# Altium schematic sheet JetsonNano_v1.SchDoc
size A2
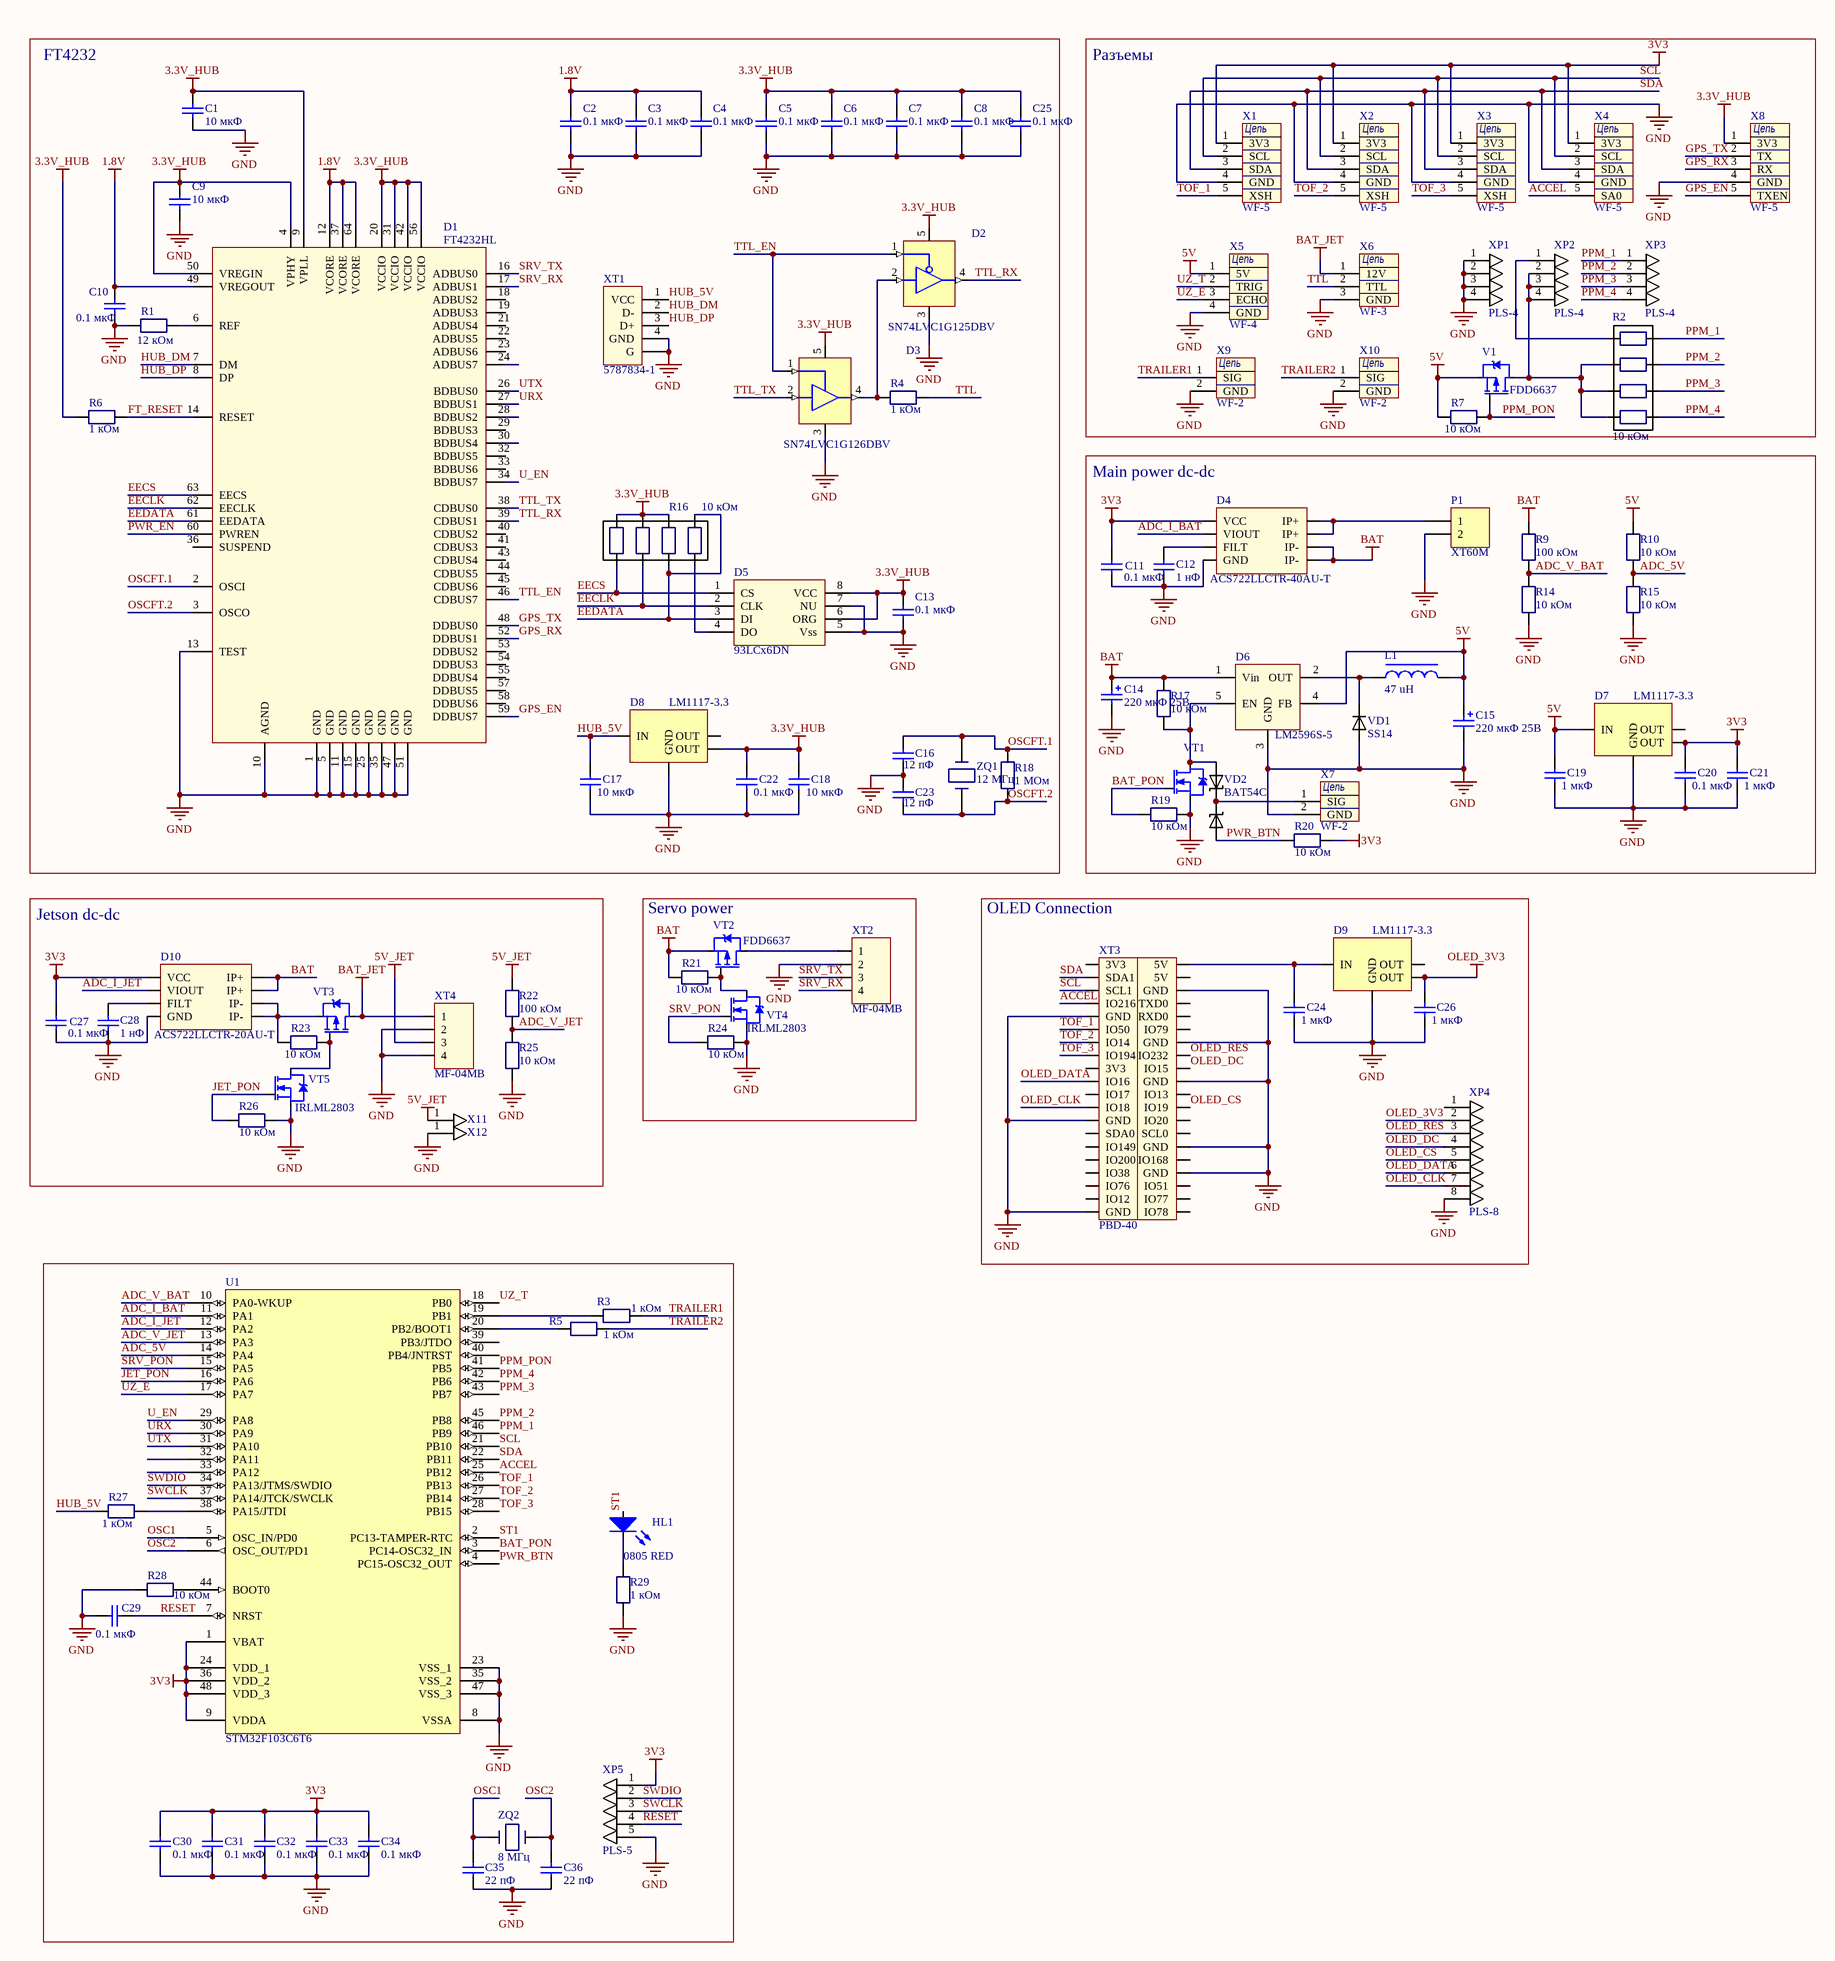
[diagram p0: JetsonNano_v1.SchDoc]

## Parts
C1  value 10 мкФ  [0805]  (hidden comment: C0805)
C2  value 0.1 мкФ  [0805]  (hidden comment: C0805)
C3  value 0.1 мкФ  [0805]  (hidden comment: C0805)
C4  value 0.1 мкФ  [0805]  (hidden comment: C0805)
C5  value 0.1 мкФ  [0805]  (hidden comment: C0805)
C6  value 0.1 мкФ  [0805]  (hidden comment: C0805)
C7  value 0.1 мкФ  [0805]  (hidden comment: C0805)
C8  value 0.1 мкФ  [0805]  (hidden comment: C0805)
C9  value 10 мкФ  [0805]  (hidden comment: C0805)
C10  value 0.1 мкФ  [0805]  (hidden comment: C0805)
C11  value 0.1 мкФ  [0805]  (hidden comment: C0805)
C12  value 1 нФ  [0805]  (hidden comment: C0805)
C13  value 0.1 мкФ  [0805]  (hidden comment: C0805)
C14  220 мкФ 25В  [CAPPR3.5-8x12]
C15  220 мкФ 25В  [CAPPR3.5-8x12]
C16  value 12 пФ  [0805]  (hidden comment: C0805)
C17  value 10 мкФ  [0805]  (hidden comment: C0805)
C18  value 10 мкФ  [0805]  (hidden comment: C0805)
C19  value 1 мкФ  [0805]  (hidden comment: C0805)
C20  value 0.1 мкФ  [0805]  (hidden comment: C0805)
C21  value 1 мкФ  [0805]  (hidden comment: C0805)
C22  value 0.1 мкФ  [0805]  (hidden comment: C0805)
C23  value 12 пФ  [0805]  (hidden comment: C0805)
C24  value 1 мкФ  [0805]  (hidden comment: C0805)
C25  value 0.1 мкФ  [0805]  (hidden comment: C0805)
C26  value 1 мкФ  [0805]  (hidden comment: C0805)
C27  value 0.1 мкФ  [0805]  (hidden comment: C0805)
C28  value 1 нФ  [0805]  (hidden comment: C0805)
C29  value 0.1 мкФ  [0805]  (hidden comment: C0805)
C30  value 0.1 мкФ  [0805]  (hidden comment: C0805)
C31  value 0.1 мкФ  [0805]  (hidden comment: C0805)
C32  value 0.1 мкФ  [0805]  (hidden comment: C0805)
C33  value 0.1 мкФ  [0805]  (hidden comment: C0805)
C34  value 0.1 мкФ  [0805]  (hidden comment: C0805)
C35  value 22 пФ  [0805]  (hidden comment: C0805)
C36  value 22 пФ  [0805]  (hidden comment: C0805)
D1  FT4232HL  [FT4232HL]
D2  SN74LVC1G125DBV  [SOT23-5]
D3  SP: SN74LVC1G126DBV  [SOT23-5]  (hidden comment: SN74LVC1G126DBV_1)
D4  ACS722LLCTR-40AU-T  [SOIC-8]
D5  93LCx6DN  [SOIC-8]
D6  LM2596S-5  [TO-263]
D7  LM1117-3.3  [SOT223]
D8  LM1117-3.3  [SOT223]
D9  LM1117-3.3  [SOT223]
D10  ACS722LLCTR-20AU-T  [SOIC-8]
HL1  0805 RED  [LED0805]
L1  47 uH  [CDRH127]
P1  XT60M  [XT60]
R1  value 12 кОм  [P0805]  (hidden comment: R0805)
R2  value 10 кОм  [ResArray4]  (hidden comment: cat16-103j4lf)
R3  value 1 кОм  [P0805]  (hidden comment: R0805 (1%))
R4  value 1 кОм  [P0805]  (hidden comment: R0805 (1%))
R5  value 1 кОм  [P0805]  (hidden comment: R0805 (1%))
R6  value 1 кОм  [P0805]  (hidden comment: R0805)
R7  value 10 кОм  [P0805]  (hidden comment: R0805 (1%))
R9  value 100 кОм  [P0805]  (hidden comment: R0805 (1%))
R10  value 10 кОм  [P0805]  (hidden comment: R0805 (1%))
R14  value 10 кОм  [P0805]  (hidden comment: R0805 (1%))
R15  value 10 кОм  [P0805]  (hidden comment: R0805 (1%))
R16  value 10 кОм  [ResArray4]  (hidden comment: cat16-103j4lf)
R17  value 10 кОм  [P0805]  (hidden comment: R0805)
R18  value 1 МОм  [P0805]  (hidden comment: R0805)
R19  value 10 кОм  [P0805]  (hidden comment: R0805)
R20  value 10 кОм  [P0805]  (hidden comment: R0805)
R21  value 10 кОм  [P0805]  (hidden comment: R0805 (1%))
R22  value 100 кОм  [P0805]  (hidden comment: R0805 (1%))
R23  value 10 кОм  [P0805]  (hidden comment: R0805 (1%))
R24  value 10 кОм  [P0805]  (hidden comment: R0805)
R25  value 10 кОм  [P0805]  (hidden comment: R0805 (1%))
R26  value 10 кОм  [P0805]  (hidden comment: R0805)
R27  value 1 кОм  [P0805]  (hidden comment: R0805 (1%))
R28  value 10 кОм  [P0805]  (hidden comment: R0805)
R29  value 1 кОм  [P0805]  (hidden comment: R0805 (1%))
U1  STM32F103C6T6  [LQFP-48]
V1  FDD6637  [TO-252]
VD1  SS14  [SMA]
VD2  BAT54C  [SOT-23]
VT1  IRLML2803  [SOT-23]  (value not drawn)
VT2  FDD6637  [TO-252]
VT3  D2PAK_P_CH  [TO-263-2]  (value not drawn)
VT4  IRLML2803  [SOT-23]
VT5  IRLML2803  [SOT-23]
X1  WF-5  [WF-5]
X2  WF-5  [WF-5]
X3  WF-5  [WF-5]
X4  WF-5  [WF-5]
X5  WF-4  [WF-4]
X6  WF-3  [WF-3]
X7  WF-2  [WF-2]
X8  WF-5  [WF-5]
X9  WF-2  [WF-2]
X10  WF-2  [WF-2]
X11  (no value)  [Pad2]
X12  (no value)  [Pad2]
XP1  PLS-4  [PLS-4]
XP2  PLS-4  [PLS-4]
XP3  PLS-4  [PLS-4]
XP4  PLS-8  [PLS-8]
XP5  PLS-5  [PLS-5]
XT1  value 5787834-1  [USB_B]  (hidden comment: 1734366-1)
XT2  value MF-04MB  [MF-04MB]  (hidden comment: MF-04MRA)
XT3  PBD-40  [PBD-40RB]
XT4  value MF-04MB  [MF-04MB]  (hidden comment: MF-04MRA)
ZQ1  value 12 МГц  [HC-49/U]  (hidden comment: 8 МГц)
ZQ2  8 МГц  [HC-49/U]

## Blocks framed on the sheet
FT4232: C1-C10 C13 C16-C18 C22 C23 C25 D1-D3 D5 D8 R1 R4 R6 R16 R18 XT1 ZQ1
Разъемы: R2 R7 V1 X1-X6 X8-X10 XP1-XP3
Main power dc-dc: C11 C12 C14 C15 C19-C21 D4 D6 D7 L1 P1 R9 R10 R14 R15 R17 R19 R20 VD1 VD2 VT1 X7
Jetson dc-dc: C27 C28 D10 R22 R23 R25 R26 VT3 VT5 X11 X12 XT4
Servo power: R21 R24 VT2 VT4 XT2
OLED Connection: C24 C26 D9 XP4 XT3

## Nets
1.8V: C2.2 C3.2 C4.2 C10.2 D1.12(VCORE) D1.37(VCORE) D1.49(VREGOUT) D1.64(VCORE)
3.3V_HUB: C1.2 C5.2 C6.2 C7.2 C8.2 C9.2 C13.2 C18.2 C22.2 C25.2 D1.4(VPHY) D1.9(VPLL) D1.20(VCCIO) D1.31(VCCIO) D1.42(VCCIO) D1.50(VREGIN) D1.56(VCCIO) D2.5(VCC) D3.5(VCC) D5.6(ORG) D5.8(VCC) D8.4(OUT) R6.2 R16.6 R16.7 R16.8 X8.1(3V3)
3V3: C11.1 C20.2 C21.2 C27.1 C30.2 C31.2 C32.2 C33.2 C34.2 D4.8(VCC) D7.4(OUT) D10.8(VCC) R20.1 U1.1(VBAT) U1.9(VDDA) U1.24(VDD_1) U1.36(VDD_2) U1.48(VDD_3) X1.1(3V3) X2.1(3V3) X3.1(3V3) X4.1(3V3) XP5.1
5V: C15.1 C19.2 D6.4(FB) D7.3(IN) L1.2 R7.1 R10.2 V1.3(S) X5.1(5V)
5V_JET: R22.2 X11.1 XT4.3
BAT: C14.1 D4.3(IP-) D4.4(IP-) D6.1(Vin) D10.1(IP+) D10.2(IP+) R9.2 R17.1 R21.1 VT2.3(S)
BAT_JET: VT3.2(D) X6.1(12V) XT4.1
GND: C1.1 C2.1 C3.1 C4.1 C5.1 C6.1 C7.1 C8.1 C9.1 C10.1 C11.2 C12.1 C13.1 C14.2 C15.2 C16.1 C17.1 C18.1 C19.1 C20.1 C21.1 C22.1 C23.2 C24.1 C25.1 C26.1 C27.2 C28.1 C29.2 C30.1 C31.1 C32.1 C33.1 C34.1 C35.1 C36.1 D1.1(GND) D1.5(GND) D1.10(AGND) D1.11(GND) D1.13(TEST) D1.15(GND) D1.25(GND) D1.35(GND) D1.47(GND) D1.51(GND) D2.3(GND) D3.3(GND) D4.5(GND) D5.5(Vss) D5.7(NU) D6.3(GND) D7.1(GND) D8.1(GND) D9.1(GND) D10.5(GND) P1.2 R1.2 R14.2 R15.2 R19.1 R24.1 R25.2 R26.1 R28.2 R29.1 U1.8(VSSA) U1.23(VSS_1) U1.35(VSS_2) U1.47(VSS_3) VD1.2(A) VT1.2(S) VT4.2(S) VT5.2(S) X1.4(GND) X2.4(GND) X3.4(GND) X4.4(GND) X5.4(GND) X6.3(GND) X7.2(GND) X8.4(GND) X9.2(GND) X10.2(GND) X12.1 XP1.1 XP1.2 XP1.3 XP1.4 XP4.8 XP5.5 XT1.4(GND) XT1.G XT2.2 XT3.6(GND) XT3.9(GND) XT3.14(GND) XT3.20(GND) XT3.25(GND) XT3.30(GND) XT3.34(GND) XT3.39(GND) XT4.2 XT4.4
OLED_3V3: C26.2 D9.4(OUT) XP4.2
ACCEL: U1.25(PB12) X4.5(SA0) XT3.7(IO216)
ADC_5V: R10.1 R15.1 U1.14(PA4)
ADC_I_BAT: D4.7(VIOUT) U1.11(PA1)
ADC_I_JET: D10.7(VIOUT) U1.12(PA2)
ADC_V_BAT: R9.1 R14.1 U1.10(PA0-WKUP)
ADC_V_JET: R22.1 R25.1 U1.13(PA3)
BAT_PON: R19.2 U1.3(PC14-OSC32_IN) VT1.1(G)
EECLK: D1.62(EECLK) D5.2(CLK) R16.2
EECS: D1.63(EECS) D5.1(CS) R16.1
EEDATA: D1.61(EEDATA) D5.3(DI) R16.3 R16.5
FT_RESET: D1.14(RESET) R6.1
GPS_EN: D1.59(DDBUS7) X8.5(TXEN)
GPS_RX: D1.52(DDBUS1) X8.3(RX)
GPS_TX: D1.48(DDBUS0) X8.2(TX)
HUB_5V: C17.2 D8.3(IN) R27.1 XT1.1(VCC)
HUB_DM: D1.7(DM) XT1.2(D-)
HUB_DP: D1.8(DP) XT1.3(D+)
JET_PON: R26.2 U1.16(PA6) VT5.1(G)
OLED_CLK: XP4.7 XT3.23(IO18)
OLED_CS: XP4.5 XT3.24(IO19)
OLED_DATA: XP4.6 XT3.19(IO16)
OLED_DC: XP4.4 XT3.18(IO15)
OLED_RES: XP4.3 XT3.16(IO232)
OSC1: C35.2 U1.5(OSC_IN/PD0) ZQ2.1
OSC2: C36.2 U1.6(OSC_OUT/PD1) ZQ2.2
OSCFT.1: C16.2 D1.2(OSCI) R18.1 ZQ1.2
OSCFT.2: C23.1 D1.3(OSCO) R18.2 ZQ1.1
PPM_1: R2.5 U1.46(PB9) XP3.1
PPM_2: R2.6 U1.45(PB8) XP3.2
PPM_3: R2.7 U1.43(PB7) XP3.3
PPM_4: R2.8 U1.42(PB6) XP3.4
PPM_PON: R7.2 U1.41(PB5) V1.1(G)
PWR_BTN: R20.2 U1.4(PC15-OSC32_OUT) VD2.1(A)
PWR_EN: D1.60(PWREN)
RESET: C29.1 U1.7(NRST) XP5.4
SCL: U1.21(PB10) X1.2(SCL) X2.2(SCL) X3.2(SCL) X4.2(SCL) XT3.5(SCL1)
SDA: U1.22(PB11) X1.3(SDA) X2.3(SDA) X3.3(SDA) X4.3(SDA) XT3.3(SDA1)
SRV_PON: R24.2 U1.15(PA5) VT4.1(G)
SRV_RX: D1.17(ADBUS1) XT2.4
SRV_TX: D1.16(ADBUS0) XT2.3
ST1: HL1.1(A) U1.2(PC13-TAMPER-RTC)
SWCLK: U1.37(PA14/JTCK/SWCLK) XP5.3
SWDIO: U1.34(PA13/JTMS/SWDIO) XP5.2
TOF_1: U1.26(PB13) X1.5(XSH) XT3.11(IO50)
TOF_2: U1.27(PB14) X2.5(XSH) XT3.13(IO14)
TOF_3: U1.28(PB15) X3.5(XSH) XT3.15(IO194)
TRAILER1: R3.1 X9.1(SIG)
TRAILER2: R5.1 X10.1(SIG)
TTL: R4.2 X6.2(TTL)
TTL_EN: D1.46(CDBUS7) D2.1(A) D3.1(A)
TTL_RX: D1.39(CDBUS1) D2.4(OUT)
TTL_TX: D1.38(CDBUS0) D3.2(B)
U_EN: D1.34(BDBUS7) U1.29(PA8)
URX: D1.27(BDBUS1) U1.30(PA9)
UTX: D1.26(BDBUS0) U1.31(PA10)
UZ_E: U1.17(PA7) X5.3(ECHO)
UZ_T: U1.18(PB0) X5.2(TRIG)
NetC12_2: C12.2 D4.6(FILT)
NetC24_2: C24.2 D9.3(IN) XT3.2(5V)
NetC28_2: C28.2 D10.6(FILT)
NetD1_6: D1.6(REF) R1.1
NetD2_2: D2.2(B) D3.4(OUT) R4.1
NetD4_1: D4.1(IP+) D4.2(IP+) P1.1
NetD5_4: D5.4(DO) R16.4
NetD6_2: D6.2(OUT) L1.1 VD1.1(K)
NetD6_5: D6.5(EN) R17.2 VD2.2(A) VT1.3(D)
NetD10_3: D10.3(IP-) D10.4(IP-) R23.1 VT3.3(S)
NetHL1_2: HL1.2(C) R29.2
NetR2_1: R2.1 R2.2 R2.3 V1.2(D) XP2.2 XP2.3 XP2.4
NetR2_4: R2.4 XP2.1
NetR3_2: R3.2 U1.19(PB1)
NetR5_2: R5.2 U1.20(PB2/BOOT1)
NetR21_2: R21.2 VT2.1(G) VT4.3(D)
NetR23_2: R23.2 VT3.1(G) VT5.3(D)
NetR27_2: R27.2 U1.38(PA15/JTDI)
NetR28_1: R28.1 U1.44(BOOT0)
NetVD2_3: VD2.3(K) X7.1(SIG)
NetVT2_2: VT2.2(D) XT2.1

Not connected (* = marked no-connect by the designer): D1 18(ADBUS2) 19(ADBUS3) 21(ADBUS4) 22(ADBUS5) 23(ADBUS6) 24(ADBUS7) 28(BDBUS2) 29(BDBUS3) 30(BDBUS4) 32(BDBUS5) 33(BDBUS6) 36(SUSPEND) 40(CDBUS2) 41(CDBUS3) 43(CDBUS4) 44(CDBUS5) 45(CDBUS6) 53(DDBUS2) 54(DDBUS3) 55(DDBUS4) 57(DDBUS5) 58(DDBUS6); D7 2(OUT); D8 2(OUT); D9 2(OUT); U1 32(PA11) 33(PA12) 39(PB3/JTDO) 40(PB4/JNTRST); XP4 1; XT3 1(3V3) 4(5V) 8(TXD0) 10(RXD0) 12(IO79) 17(3V3) 21(IO17) 22(IO13) 26(IO20) 27(SDA0) 28(SCL0) 29(IO149) 31(IO200) 32(IO168) 33(IO38) 35(IO76) 36(IO51) 37(IO12) 38(IO77) 40(IO78)

## Notes on the sheet
- (in symbol WF-2) Цепь
- (in symbol WF-3) Цепь
- (in symbol WF-4) Цепь
- (in symbol WF-5) Цепь

## Library data of the parts
C1-C13 C16-C36 = C0805: Чип конденсатор 0805; SP: Чип конденсатор 0805 X7R
C14 C15 = K50-35: Чип конденсатор танталовый "A"; SP: Конденсатор  SH025M0220A5S-0811; Value: 220 мкФ 25В
D4 D10 = ACS712
  D4: SP: ACS722LLCTR-40AU-T
  D10: SP: ACS722LLCTR-20AU-T
D5 = 93LC46: Microwire Serial EEPROM; Value: EEPROM; SP: 93LCx6DN
D6 = LM2596S-ADJ: SP: Микросхема LM2596S-5
D7-D9 = LM1117: SP: LM1117-3.3
HL1 = LED: Value: 0805 RED
L1 = CDRH127/LDNP-330MC: SMD Дроссель 12x12 mm; SP: CDRH127/LDNP-330MC; Value: 47 uH
P1 = Header 1X2: Header, 3-Pin, Dual row; SP: XT60M
R1 R6 R17-R20 R24 R26 R28 = R0805: Чип резистор 0805, 1%; SP: Чип резистор 0805
R2 R16 = cat16-103j4lf: Resistor array; SP: cat16-103j4lf
R3-R5 R7 R9 R10 R14 R15 R21-R23 R25 R27 R29 = R0805 (1%): Чип резистор 0805, 1%; SP: Чип резистор 0805
U1 = STM32F103C6T6: STM32 ARM-based 32-bit MCU with 32 Kbytes Flash, 48-pin LQFP, Industrial Temperature; Published: 30-May-2008; DatasheetVersion: rev6, Mar-2008; PackageVersion: Mar-2008; PackageReference: LQFP48; Publisher: Altium Limited; PackageDescription: 48-Pin Low-Profile Quad Flat Pack, 7 x 7 mm Body, 0.5 mm Pitch (LQFP48); ComponentLink1Description: Manufacturer Link; ComponentLink1URL: www.st.com/stm32; ComponentLink2Description: Datasheet; ComponentLink2URL: http://www.st.com/stonline/products/literature/ds/13587.pdf; SP: STM32F103C6T6
V1 VT2 = IRFR5305: SP: FDD6637
VD1 = diode: SP: SS14
VT1 VT4 VT5 = IRLML2803: IRLML2803 Полевой транзистор; SP: Транзистор IRLML2803
VT3 = D2PAK_P_CH: SP: D2PAK P channel transistor
X1-X4 X8 = WF-5: Вилка на плату 2.54; SP: WR-5, Вилка на плату 2.54
X5 = WF-4: Вилка на плату 2.54; SP: WR-4, Вилка на плату 2.54
X6 = WF-3: Вилка на плату 2.54; SP: WR-3, Вилка на плату 2.54
X7 X9 X10 = WF-2: Вилка на плату 2.54; SP: WR-2, Вилка на плату 2.54
X11 X12 = Pad
XP1-XP3 = PLS-4: Вилка угловая однорядная, шаг 2,54мм; Value: PLS-4; SP: PLS-4
XP4 = PLS-8: Вилка угловая однорядная, шаг 2,54мм; SP: PLS-8
XT1 = USB_A/B: USB; SP: USB_A; Value: USBA-1J; Value: USBB-1J; Value: 1734366-1
XT2 XT4 = MF-04M: Mini-Fit; SP: Connector; Value: MF-04MRA
XT3 = PBD-40_JetsonNano: SP: Вилка штыревая 2.54мм; Value: PBD-40
ZQ1 ZQ2 = HC49U-8M0: Кварцевый резонатор d3x8мм; SP: HC49S
  ZQ2: Value: 8 МГц
D1 = FT4232HL: SP: FT4232HL
D2 = SN74LVC1G125DBV: SP: SN74LVC1G125DBV
VD2 = BAT54C: SP: BAT54C
XP5 = PLS-5: SP: PLS-5